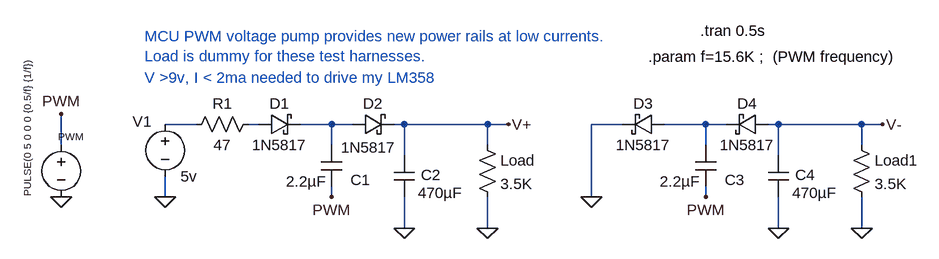
[diagram p0: schematic PWM_Voltage_Doubler.asc]
PWM_Voltage_Doubler.asc, the LTspice schematic file:
Version 4
SHEET 1 1364 680
WIRE 96 32 48 32
WIRE 192 32 176 32
WIRE 304 32 256 32
WIRE 336 32 304 32
WIRE 416 32 400 32
WIRE 544 32 416 32
WIRE 576 32 544 32
WIRE 752 32 704 32
WIRE 880 32 816 32
WIRE 912 32 880 32
WIRE 992 32 976 32
WIRE 1120 32 992 32
WIRE 1152 32 1120 32
WIRE -112 64 -112 16
WIRE 304 64 304 32
WIRE 544 64 544 32
WIRE 880 64 880 32
WIRE 1120 64 1120 32
WIRE 416 80 416 32
WIRE 992 80 992 32
WIRE 48 144 48 112
WIRE 304 144 304 128
WIRE 704 144 704 32
WIRE 880 144 880 128
WIRE 416 192 416 144
WIRE 544 192 544 144
WIRE 992 192 992 144
WIRE 1120 192 1120 144
FLAG 416 192 0
FLAG 576 32 V+
FLAG -112 144 0
FLAG 48 144 0
FLAG 544 192 0
FLAG 304 144 PWM
FLAG -112 16 PWM
FLAG 992 192 0
FLAG 704 144 0
FLAG 1120 192 0
FLAG 880 144 PWM
FLAG 1152 32 V-
SYMBOL schottky 192 48 R270
WINDOW 0 32 32 VTop 2
WINDOW 3 0 32 VBottom 2
SYMATTR InstName D1
SYMATTR Value 1N5817
SYMATTR Description Diode
SYMATTR Type diode
SYMBOL schottky 336 48 R270
WINDOW 0 32 32 VTop 2
WINDOW 3 -4 25 VBottom 2
SYMATTR InstName D2
SYMATTR Value 1N5817
SYMATTR Description Diode
SYMATTR Type diode
SYMBOL cap 320 128 R180
WINDOW 0 -44 10 Left 2
WINDOW 3 24 8 Left 2
SYMATTR InstName C1
SYMATTR Value 2.2µF
SYMBOL voltage -112 48 M0
WINDOW 123 0 0 Left 2
WINDOW 39 0 0 Left 2
WINDOW 3 52 -111 VRight 1
WINDOW 0 -34 3 Left 1
SYMATTR Value PULSE(0 5 0 0 0 {0.5/f} {1/f})
SYMATTR InstName PWM
SYMBOL cap 400 80 R0
WINDOW 0 42 30 Left 2
WINDOW 3 37 58 Left 2
SYMATTR InstName C2
SYMATTR Value 470µF
SYMBOL voltage 48 16 R0
WINDOW 0 -50 12 Left 2
WINDOW 123 0 0 Left 0
WINDOW 39 0 0 Left 0
SYMATTR InstName V1
SYMATTR Value 5v
SYMBOL res 528 48 R0
SYMATTR InstName Load
SYMATTR Value 3.5K
SYMBOL res 192 16 R90
WINDOW 0 0 56 VBottom 2
WINDOW 3 32 56 VTop 2
SYMATTR InstName R1
SYMATTR Value 47
SYMBOL schottky 816 16 R90
WINDOW 0 0 32 VBottom 2
WINDOW 3 32 32 VTop 2
SYMATTR InstName D3
SYMATTR Value 1N5817
SYMATTR Description Diode
SYMATTR Type diode
SYMBOL schottky 976 16 R90
WINDOW 0 0 32 VBottom 2
WINDOW 3 32 32 VTop 2
SYMATTR InstName D4
SYMATTR Value 1N5817
SYMATTR Description Diode
SYMATTR Type diode
SYMBOL cap 896 128 R180
WINDOW 0 -44 10 Left 2
WINDOW 3 24 8 Left 2
SYMATTR InstName C3
SYMATTR Value 2.2µF
SYMBOL cap 976 80 R0
WINDOW 0 42 30 Left 2
WINDOW 3 37 58 Left 2
SYMATTR InstName C4
SYMATTR Value 470µF
SYMBOL res 1104 48 R0
SYMATTR InstName Load1
SYMATTR Value 3.5K
TEXT 792 -72 Left 2 !.param f=15.6K ;  (PWM frequency)
TEXT 872 -112 Left 2 !.tran 0.5s
TEXT 16 -40 Left 2 ;V >9v, I < 2ma needed to drive my LM358
TEXT 16 -104 Left 2 ;MCU PWM voltage pump provides new power rails at low currents.\nLoad is dummy for these test harnesses.

The netlist it stands for:
* PWM_Voltage_Doubler.asc
D1 N002 N003 1N5817
D2 N003 V+ 1N5817
C1 PWM N003 2.2µF
V§PWM PWM 0 PULSE(0 5 0 0 0 {0.5/f} {1/f})
C2 V+ 0 470µF
V1 N001 0 5v
R§Load V+ 0 3.5K
R1 N002 N001 47
D3 N004 0 1N5817
D4 V- N004 1N5817
C3 PWM N004 2.2µF
C4 V- 0 470µF
R§Load1 V- 0 3.5K
.model D D
.lib standard.dio
.param f=15.6K ;  (PWM frequency)
.tran 0.5s
* V >9v, I < 2ma needed to drive my LM358
* MCU PWM voltage pump provides new power rails at low currents.
* Load is dummy for these test harnesses.
.backanno
.end